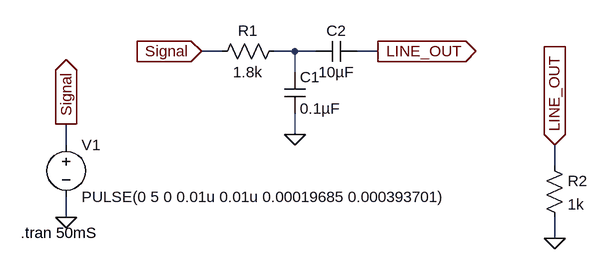
[diagram p0: schematic line-out_simulation_1.asc]
line-out_simulation_1.asc, the LTspice schematic file:
Version 4
SHEET 1 952 680
WIRE 256 -32 224 -32
WIRE 368 -32 336 -32
WIRE 400 -32 368 -32
WIRE 496 -32 464 -32
WIRE 368 0 368 -32
WIRE 368 96 368 64
WIRE 16 112 16 80
WIRE 768 144 768 112
WIRE 16 224 16 192
WIRE 768 256 768 224
FLAG 16 224 0
FLAG 16 80 Signal
IOPIN 16 80 Out
FLAG 368 96 0
FLAG 496 -32 LINE_OUT
IOPIN 496 -32 Out
FLAG 224 -32 Signal
IOPIN 224 -32 In
FLAG 768 256 0
FLAG 768 112 LINE_OUT
IOPIN 768 112 In
SYMBOL voltage 16 96 R0
WINDOW 123 0 0 Left 0
WINDOW 39 0 0 Left 0
SYMATTR InstName V1
SYMATTR Value PULSE(0 5 0 0.01u 0.01u 0.00019685 0.000393701)
SYMBOL res 352 -48 R90
WINDOW 0 0 56 VBottom 2
WINDOW 3 32 56 VTop 2
SYMATTR InstName R1
SYMATTR Value 1.8k
SYMBOL cap 352 0 R0
SYMATTR InstName C1
SYMATTR Value 0.1µF
SYMBOL cap 464 -48 R90
WINDOW 0 0 32 VBottom 2
WINDOW 3 32 32 VTop 2
SYMATTR InstName C2
SYMATTR Value 10µF
SYMBOL res 752 128 R0
SYMATTR InstName R2
SYMATTR Value 1k
TEXT -54 248 Left 2 !.tran 50mS

The netlist it stands for:
* line-out_simulation_1.asc
V1 Signal 0 PULSE(0 5 0 0.01u 0.01u 0.00019685 0.000393701)
R1 N001 Signal 1.8k
C1 N001 0 0.1µF
C2 LINE_OUT N001 10µF
R2 LINE_OUT 0 1k
.tran 50mS
.backanno
.end